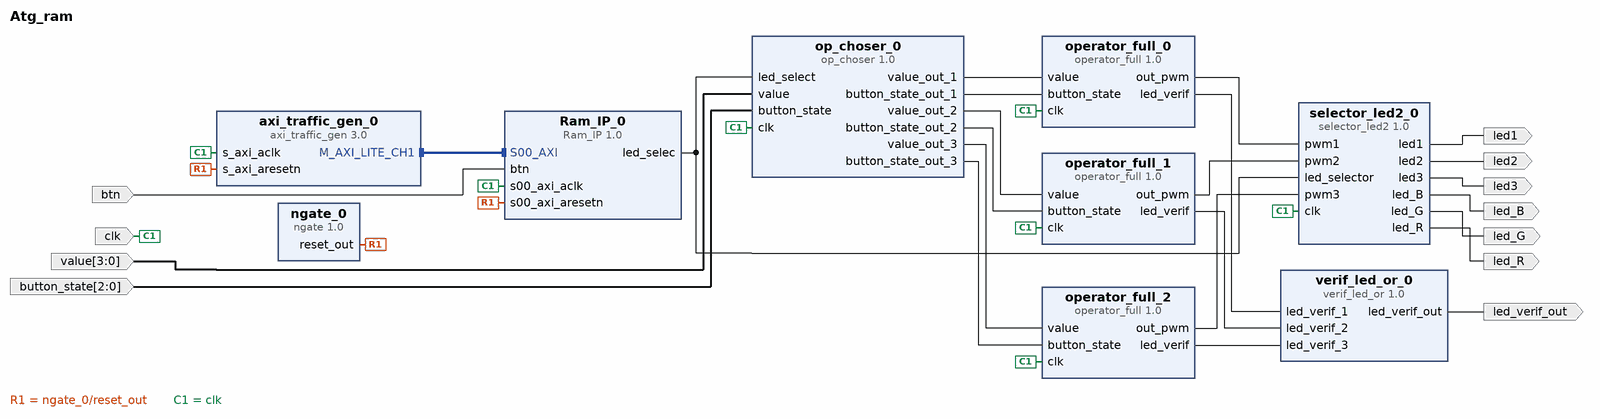
[diagram p0: block diagram of the top level]
# Vivado block design Atg_ram, xc7z010clg400-1, Vivado 2020.1
create_bd_design Atg_ram

create_bd_port -dir I btn
create_bd_port -dir I -from 3 -to 0 value
create_bd_port -dir I -from 2 -to 0 button_state
create_bd_port -dir O led1
create_bd_port -dir O led2
create_bd_port -dir O led3
create_bd_port -dir O led_R
create_bd_port -dir O led_G
create_bd_port -dir O led_B
create_bd_port -dir O led_verif_out
create_bd_port -dir I -type clk clk

create_bd_cell -type ip -vlnv xilinx.com:user:selector_led2:1.0 selector_led2_0
create_bd_cell -type ip -vlnv xilinx.com:user:verif_led_or:1.0 verif_led_or_0
create_bd_cell -type ip -vlnv xilinx.com:user:operator_full:1.0 operator_full_0
create_bd_cell -type ip -vlnv xilinx.com:user:operator_full:1.0 operator_full_1
create_bd_cell -type ip -vlnv xilinx.com:user:operator_full:1.0 operator_full_2
create_bd_cell -type ip -vlnv xilinx.com:user:op_choser:1.0 op_choser_0
create_bd_cell -type ip -vlnv xilinx.com:ip:axi_traffic_gen:3.0 axi_traffic_gen_0
set_property -dict [list \
  CONFIG.C_ATG_MODE AXI4-Lite \
  CONFIG.C_ATG_SYSINIT_MODES System_Test \
  CONFIG.C_ATG_SYSTEM_CMD_MAX_RETRY 2147483647 \
  CONFIG.C_ATG_SYSTEM_INIT_ADDR_MIF ../../../../../../../../Ay4_coe_files/addr.coe \
  CONFIG.C_ATG_SYSTEM_INIT_CTRL_MIF ../../../../../../../../Ay4_coe_files/ctrl.coe \
  CONFIG.C_ATG_SYSTEM_INIT_DATA_MIF ../../../../../../../../Ay4_coe_files/data.coe \
  CONFIG.C_ATG_SYSTEM_INIT_MASK_MIF ../../../../../../../../Ay4_coe_files/mask.coe \
] [get_bd_cells axi_traffic_gen_0]
create_bd_cell -type ip -vlnv xilinx.com:user:ngate:1.0 ngate_0
create_bd_cell -type ip -vlnv xilinx.com:user:Ram_IP:1.0 Ram_IP_0

# ---- connections ----

connect_bd_intf_net [get_bd_intf_pins axi_traffic_gen_0/M_AXI_LITE_CH1] [get_bd_intf_pins Ram_IP_0/S00_AXI]
connect_bd_net [get_bd_pins operator_full_0/led_verif] [get_bd_pins verif_led_or_0/led_verif_1]
connect_bd_net [get_bd_pins operator_full_1/led_verif] [get_bd_pins verif_led_or_0/led_verif_2]
connect_bd_net [get_bd_pins operator_full_2/led_verif] [get_bd_pins verif_led_or_0/led_verif_3]
connect_bd_net [get_bd_pins operator_full_0/out_pwm] [get_bd_pins selector_led2_0/pwm1]
connect_bd_net [get_bd_pins operator_full_1/out_pwm] [get_bd_pins selector_led2_0/pwm2]
connect_bd_net [get_bd_pins operator_full_2/out_pwm] [get_bd_pins selector_led2_0/pwm3]
connect_bd_net [get_bd_pins op_choser_0/value_out_1] [get_bd_pins operator_full_0/value]
connect_bd_net [get_bd_pins op_choser_0/value_out_2] [get_bd_pins operator_full_1/value]
connect_bd_net [get_bd_pins op_choser_0/value_out_3] [get_bd_pins operator_full_2/value]
connect_bd_net [get_bd_pins op_choser_0/button_state_out_1] [get_bd_pins operator_full_0/button_state]
connect_bd_net [get_bd_pins op_choser_0/button_state_out_2] [get_bd_pins operator_full_1/button_state]
connect_bd_net [get_bd_pins op_choser_0/button_state_out_3] [get_bd_pins operator_full_2/button_state]
connect_bd_net [get_bd_pins Ram_IP_0/led_selec] [get_bd_pins selector_led2_0/led_selector] [get_bd_pins op_choser_0/led_select]
connect_bd_net -net btn_0_1 [get_bd_ports btn] [get_bd_pins Ram_IP_0/btn]
connect_bd_net -net value_0_1 [get_bd_ports value] [get_bd_pins op_choser_0/value]
connect_bd_net -net button_state_0_1 [get_bd_ports button_state] [get_bd_pins op_choser_0/button_state]
connect_bd_net [get_bd_pins ngate_0/reset_out] [get_bd_pins axi_traffic_gen_0/s_axi_aresetn] [get_bd_pins Ram_IP_0/s00_axi_aresetn]
connect_bd_net [get_bd_pins selector_led2_0/led1] [get_bd_ports led1]
connect_bd_net [get_bd_pins selector_led2_0/led2] [get_bd_ports led2]
connect_bd_net [get_bd_pins selector_led2_0/led3] [get_bd_ports led3]
connect_bd_net [get_bd_pins selector_led2_0/led_R] [get_bd_ports led_R]
connect_bd_net [get_bd_pins selector_led2_0/led_G] [get_bd_ports led_G]
connect_bd_net [get_bd_pins selector_led2_0/led_B] [get_bd_ports led_B]
connect_bd_net [get_bd_pins verif_led_or_0/led_verif_out] [get_bd_ports led_verif_out]
connect_bd_net -net clk_0_1 [get_bd_ports clk] \
  [get_bd_pins operator_full_2/clk] [get_bd_pins op_choser_0/clk] [get_bd_pins operator_full_1/clk] \
  [get_bd_pins operator_full_0/clk] [get_bd_pins selector_led2_0/clk] [get_bd_pins axi_traffic_gen_0/s_axi_aclk] \
  [get_bd_pins Ram_IP_0/s00_axi_aclk]

validate_bd_design
save_bd_design
